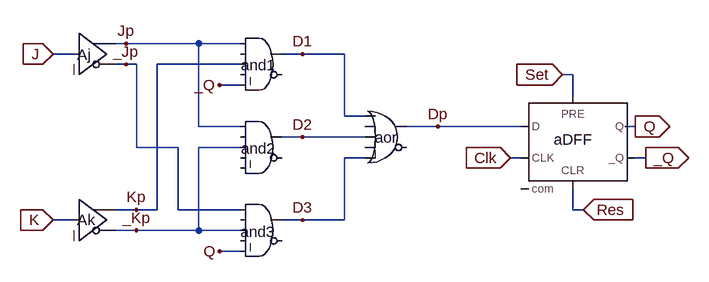
[diagram p0: schematic JkFf.asc]
JkFf.asc, the LTspice schematic file:
Version 4
SHEET 1 880 712
WIRE -576 48 -592 48
WIRE -464 48 -576 48
WIRE -400 48 -464 48
WIRE -656 64 -688 64
WIRE -304 64 -336 64
WIRE -240 64 -304 64
WIRE -576 80 -592 80
WIRE -560 80 -576 80
WIRE -400 80 -528 80
WIRE 112 96 96 96
WIRE -400 112 -432 112
WIRE 112 128 112 96
WIRE -240 160 -240 64
WIRE -208 160 -240 160
WIRE -464 176 -464 48
WIRE -400 176 -464 176
WIRE -96 176 -144 176
WIRE 32 176 -96 176
WIRE 208 176 192 176
WIRE -304 192 -336 192
WIRE -208 192 -304 192
WIRE -560 208 -560 80
WIRE -496 208 -560 208
WIRE -400 208 -464 208
WIRE -208 224 -240 224
WIRE 32 224 16 224
WIRE 224 224 208 224
WIRE -560 304 -592 304
WIRE -528 304 -528 80
WIRE -528 304 -560 304
WIRE -496 304 -496 208
WIRE -400 304 -496 304
WIRE 112 304 112 272
WIRE 128 304 112 304
WIRE -656 320 -688 320
WIRE -304 320 -336 320
WIRE -240 320 -240 224
WIRE -240 320 -304 320
WIRE -560 336 -592 336
WIRE -464 336 -464 208
WIRE -464 336 -560 336
WIRE -400 336 -464 336
WIRE -400 368 -432 368
FLAG -432 112 _Q
FLAG -304 64 D1
FLAG -304 192 D2
FLAG -432 368 Q
FLAG -304 320 D3
FLAG -96 176 Dp
FLAG 16 224 Clk
IOPIN 16 224 In
FLAG 96 96 Set
IOPIN 96 96 In
FLAG 128 304 Res
IOPIN 128 304 In
FLAG 224 224 _Q
IOPIN 224 224 Out
FLAG 208 176 Q
IOPIN 208 176 Out
FLAG -688 64 J
IOPIN -688 64 In
FLAG -576 48 Jp
FLAG -576 80 _Jp
FLAG -688 320 K
IOPIN -688 320 In
FLAG -560 304 Kp
FLAG -560 336 _Kp
SYMBOL Digital\\and -368 16 R0
WINDOW 0 -31 65 Left 0
SYMATTR InstName and1
SYMBOL Digital\\and -368 144 R0
WINDOW 0 -31 66 Left 0
SYMATTR InstName and2
SYMBOL Digital\\and -368 272 R0
WINDOW 0 -32 66 Left 0
SYMATTR InstName and3
SYMBOL Digital\\or -176 128 R0
WINDOW 0 -17 65 Left 0
SYMATTR InstName aor
SYMBOL Digital\\dflop 112 128 R0
WINDOW 0 -29 68 Left 0
SYMATTR InstName aDFF
SYMBOL Digital\\buf -656 0 R0
WINDOW 0 5 65 Left 0
SYMATTR InstName Aj
SYMBOL Digital\\buf -656 256 R0
WINDOW 0 5 64 Left 0
SYMATTR InstName Ak

The netlist it stands for:
* JkFf.asc
and1 Jp 0 Kp 0 _Q 0 D1 0 AND
and2 Jp 0 _Kp 0 0 0 D2 0 AND
and3 _Jp 0 _Kp 0 Q 0 D3 0 AND
aor D1 0 D2 0 D3 0 Dp 0 OR
aDFF Dp 0 Clk Set Res _Q Q 0 DFLOP
Aj J 0 0 0 0 _Jp Jp 0 BUF
Ak K 0 0 0 0 _Kp Kp 0 BUF
.backanno
.end